# EAGLE design 3way switch breakout (EAGLE 6.4)
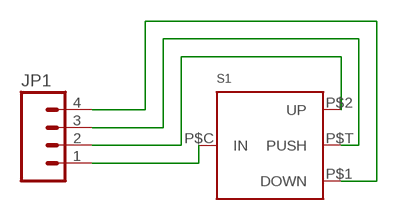
[diagram p0: schematic, sheet 1]

## Parts
JP1  M04PTH  [1X04]
S1  3WAY-NAV-SWITCH  [3WAY-NAV-SWITCH]

## Nets
N$1: JP1.1 S1.P$C(IN)
N$2: JP1.2 S1.P$2(UP)
N$3: JP1.3 S1.P$T(PUSH)
N$4: JP1.4 S1.P$1(DOWN)

## Library data of the parts
JP1 = SparkFun-Connectors:M04: Header 4 Standard 4-pin 0.1" header. Use with straight break away headers (SKU : PRT-00116), right angle break away headers (PRT-00553), swiss pins (PRT-00743), machine pins (PRT-00117), and female headers (PRT-00115). Molex polarized connector foot print use with SKU : PRT-08231 with associated crimp pins and housings. 1MM SMD Version SKU: PRT-10208
S1 = CameronTech:3WAY-NAV-SWITCH: Breakout board for the Surface Mount Navigation Switch COM-08184 from Sparkfun: https://www.sparkfun.com/products/8184 The pins on the switch are labeled as follows: C is voltage or ground input, 1 and 2 are activated when the switch is rocked towards one or the other, T is activated when the switch is pressed.

## Board
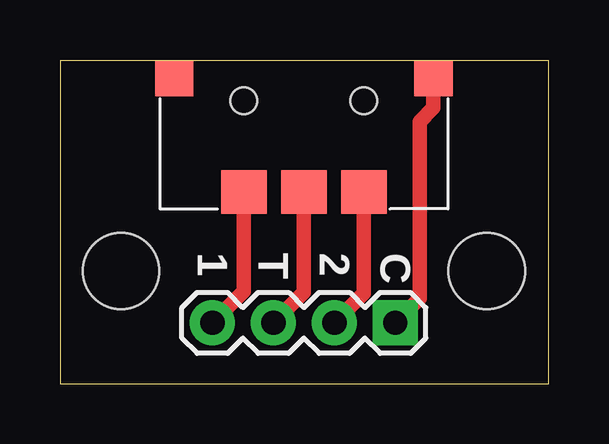
[diagram p1: board, top side]

Size 20.37 x 13.45 mm. Coordinates in mm from the lower left corner, seen from the top.
Outline: 0,0 20.37,0 20.37,13.45 0,13.45 0,0
Copper layers (1*16): Top 0.035mm / dielectric 1.5mm / Bottom 0.035mm
Design rules "default": minimum track width 10mil, minimum drill 24mil, track to track 8mil, track to pad 8mil, pad to pad 8mil, via to via 8mil, smd to smd 8mil, copper to edge 40mil, drill to drill 8mil, minimum pad ring 10mil, minimum via ring 8mil, stop-mask expansion 4mil, vias tented up to drill 0mil, thermal gap 10mil
Holes 3.17 mm at 17.78,4.7 2.54,4.7

### Footprints (pad centres in the part's own frame; a part is rotated, then mirrored left to right if it is on the bottom)
1X04 = drill 1.016 pad 1.88 square: 1 0,0 | drill 1.016 pad 1.88: 2 2.54,0; 3 5.08,0; 4 7.62,0
3WAY-NAV-SWITCH = smd 1.6 x 1.5: NULL -5.4,3.85; P$C 5.4,3.85 | smd 1.9 x 1.8: P$1 -2.5,-0.9; P$2 2.5,-0.9; P$T 0,-0.9 | hole 1.1: 2.5,2.9; -2.5,2.9

### Placement (x,y rotation side)
JP1  13.97,2.54 180 top
S1  10.16,8.89 0 top

### Tracks (layer width: path | path; a pad name or v marks a point on that pad's centre or on a via)
N$1
  Top 0.61: JP1.1 14.99,3.56 14.99,10.92 15.56,11.5 S1.P$C
N$2
  Top 0.61: JP1.2 12.66,3.77 S1.P$2
N$3
  Top 0.61: JP1.3 10.16,3.81 S1.P$T
N$4
  Top 0.61: JP1.4 7.66,3.85 S1.P$1

### Text on the board
tNames: 1 | T | 2 | C